# EAGLE design TZATZIKI_v2 (EAGLE 7.6.0)
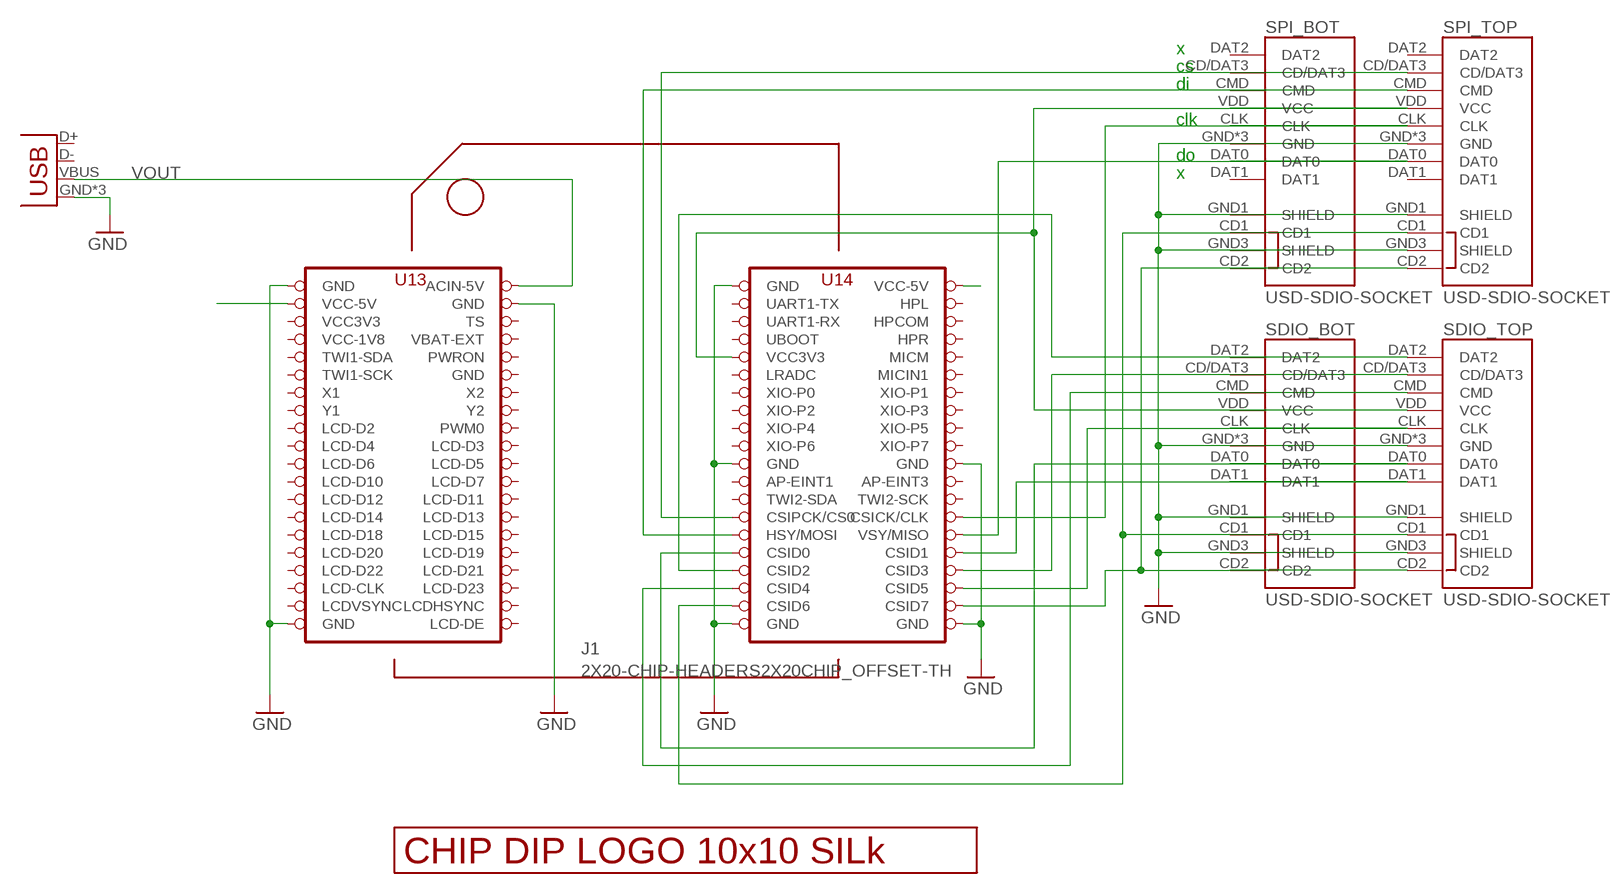
[diagram p0: schematic, sheet 1]

## Parts
J1  2X20-CHIP-HEADERS2X20CHIP_OFFSET-TH  [2X20CHIP_OFFSET-TH]
POWER_USB  USBUSB-MICROB-SMT-DIP  [USB-MICROB-SMT-DIP]
SDIO_BOT  USD-SDIO-SOCKET  [MICRO-SD-SOCKET-SDIO]
SDIO_TOP  USD-SDIO-SOCKET  [MICRO-SD-SOCKET-SDIO]
SPI_BOT  USD-SDIO-SOCKET  [MICRO-SD-SOCKET-SDIO]
SPI_TOP  USD-SDIO-SOCKET  [MICRO-SD-SOCKET-SDIO]
U$1  LOGO_10X10_SILK  [LOGO_10X10_SILK]

## Nets
GND: J1.GND@1(GND) J1.GND@2(GND) J1.GND@4(GND) J1.GND@5(GND) J1.GND@6(GND) J1.GND@7(GND) J1.GND@8(GND) J1.GND@10(GND) POWER_USB.GND POWER_USB.MT1(GND) POWER_USB.MT2(GND) SDIO_BOT.GND SDIO_BOT.GND1(SHIELD) SDIO_BOT.GND3(SHIELD) SDIO_BOT.GND@1(GND) SDIO_BOT.GND@2(GND) SDIO_TOP.GND SDIO_TOP.GND1(SHIELD) SDIO_TOP.GND3(SHIELD) SDIO_TOP.GND@1(GND) SDIO_TOP.GND@2(GND) SPI_BOT.GND SPI_BOT.GND1(SHIELD) SPI_BOT.GND3(SHIELD) SPI_BOT.GND@1(GND) SPI_BOT.GND@2(GND) SPI_TOP.GND SPI_TOP.GND1(SHIELD) SPI_TOP.GND3(SHIELD) SPI_TOP.GND@1(GND) SPI_TOP.GND@2(GND)
N$1: J1.CSID7 SDIO_BOT.CD2 SDIO_TOP.CD2 SPI_BOT.CD2 SPI_TOP.CD2
N$2: J1.CSID3 SDIO_BOT.CD/DAT3 SDIO_TOP.CD/DAT3
N$3: J1.CSID0 SDIO_BOT.DAT0 SDIO_TOP.DAT0
N$4: J1.CSID4 SDIO_BOT.CMD SDIO_TOP.CMD
N$5: J1.CSID5 SDIO_BOT.CLK SDIO_TOP.CLK
N$6: J1.CSID1 SDIO_BOT.DAT1 SDIO_TOP.DAT1
N$7: J1.VCC5V@1(VCC-5V)
N$8: J1.VCC5V@0(VCC-5V)
N$9: J1.CSID2 SDIO_BOT.DAT2 SDIO_TOP.DAT2
N$10: J1.VCC3V3@1(VCC3V3) SDIO_BOT.VDD(VCC) SDIO_TOP.VDD(VCC) SPI_BOT.VDD(VCC) SPI_TOP.VDD(VCC)
N$11: J1.CSIPCK(CSIPCK/CS0) SPI_BOT.CD/DAT3 SPI_TOP.CD/DAT3
N$12: J1.CSIHSYNC(HSY/MOSI) SPI_BOT.CMD SPI_TOP.CMD
N$13: J1.CSIVSYNC(VSY/MISO) SPI_BOT.DAT0 SPI_TOP.DAT0
N$14: J1.CSICK(CSICK/CLK) SPI_BOT.CLK SPI_TOP.CLK
N$19: J1.CSID6 SDIO_BOT.CD1 SDIO_TOP.CD1 SPI_BOT.CD1 SPI_TOP.CD1
VOUT: J1.CHG-IN(ACIN-5V) POWER_USB.VBUS
Unconnected: J1.AP-EINT1 J1.AP-EINT3 J1.BAT(VBAT-EXT) J1.FEL(UBOOT) J1.HPCOM J1.HPL J1.HPR J1.LCD-CLK J1.LCD-D2 J1.LCD-D3 J1.LCD-D4 J1.LCD-D5 J1.LCD-D6 J1.LCD-D7 J1.LCD-D10 J1.LCD-D11 J1.LCD-D12 J1.LCD-D13 J1.LCD-D14 J1.LCD-D15 J1.LCD-D18 J1.LCD-D19 J1.LCD-D20 J1.LCD-D21 J1.LCD-D22 J1.LCD-D23 J1.LCD-DE J1.LCD-HSYNC(LCDHSYNC) J1.LCD-VSYNC(LCDVSYNC) J1.LRADC J1.MICIN1 J1.MICM J1.PWM0 J1.PWRON J1.TS J1.TWI1-SCK J1.TWI1-SDA J1.TWI2-SCK J1.TWI2-SDA J1.UART1-RX J1.UART1-TX J1.X1 J1.X2 J1.XIO-P0 J1.XIO-P1 J1.XIO-P2 J1.XIO-P3 J1.XIO-P4 J1.XIO-P5 J1.XIO-P6 J1.XIO-P7 J1.Y1 J1.Y2 POWER_USB.D+ POWER_USB.D- SPI_BOT.DAT1 SPI_BOT.DAT2 SPI_TOP.DAT1 SPI_TOP.DAT2

## Notes on the sheet
- x
- cs
- di
- clk
- do
- x

## Power pins joined to a net without a drawn wire
GND: J1.GND@3(GND)
VCC3V3: J1.VCC3V3
VCC-1V8: J1.VCC1V8(VCC-1V8)

## Library data of the parts
J1 = JKW_CHIP:2X20-CHIP-HEADERS: Through hole layout with chip reference
POWER_USB = Spark:USB
SDIO_BOT SDIO_TOP SPI_BOT SPI_TOP = JKW_CHIP:USD-SDIO-SOCKET: microSD Socket Push-push type uSD socket with full SDIO signal mapping. Spark Fun Electronics SKU : PRT-00127. tDoc lines correctly indicate media card edge positions when inserting (unlocked, locked, depressed). NOTE: CD1 and CD2 are connected internally, and short to ground when card is removed.; PROD_ID: SCHD3A0100
U$1 = JKW_CHIP:LOGO_10X10_SILK

## Board
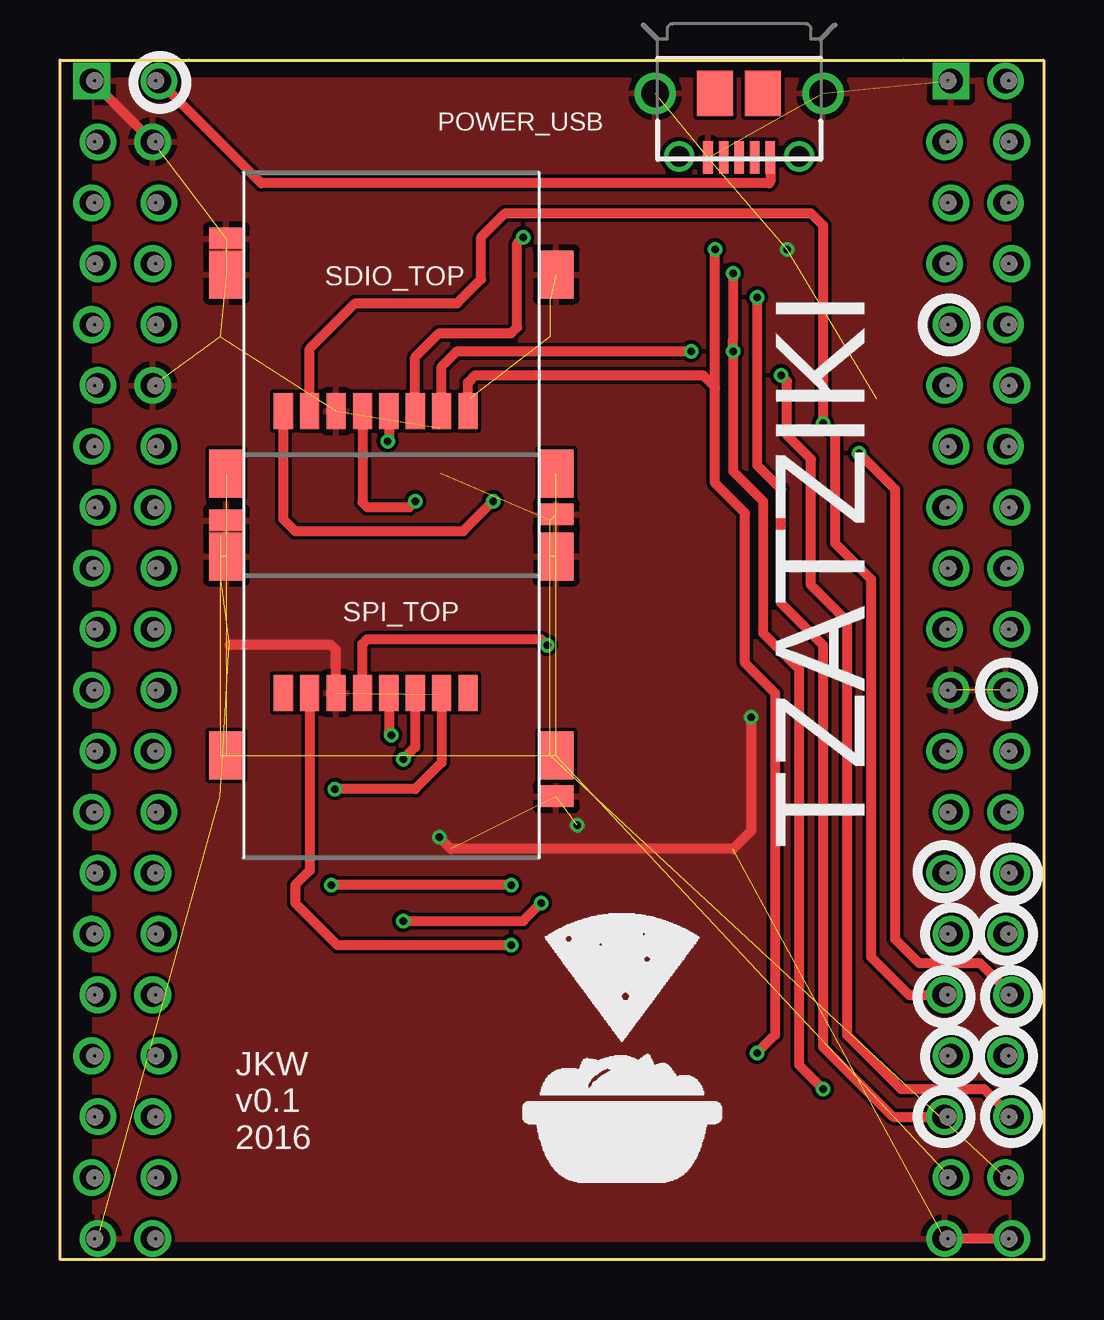
[diagram p1: board, top side]
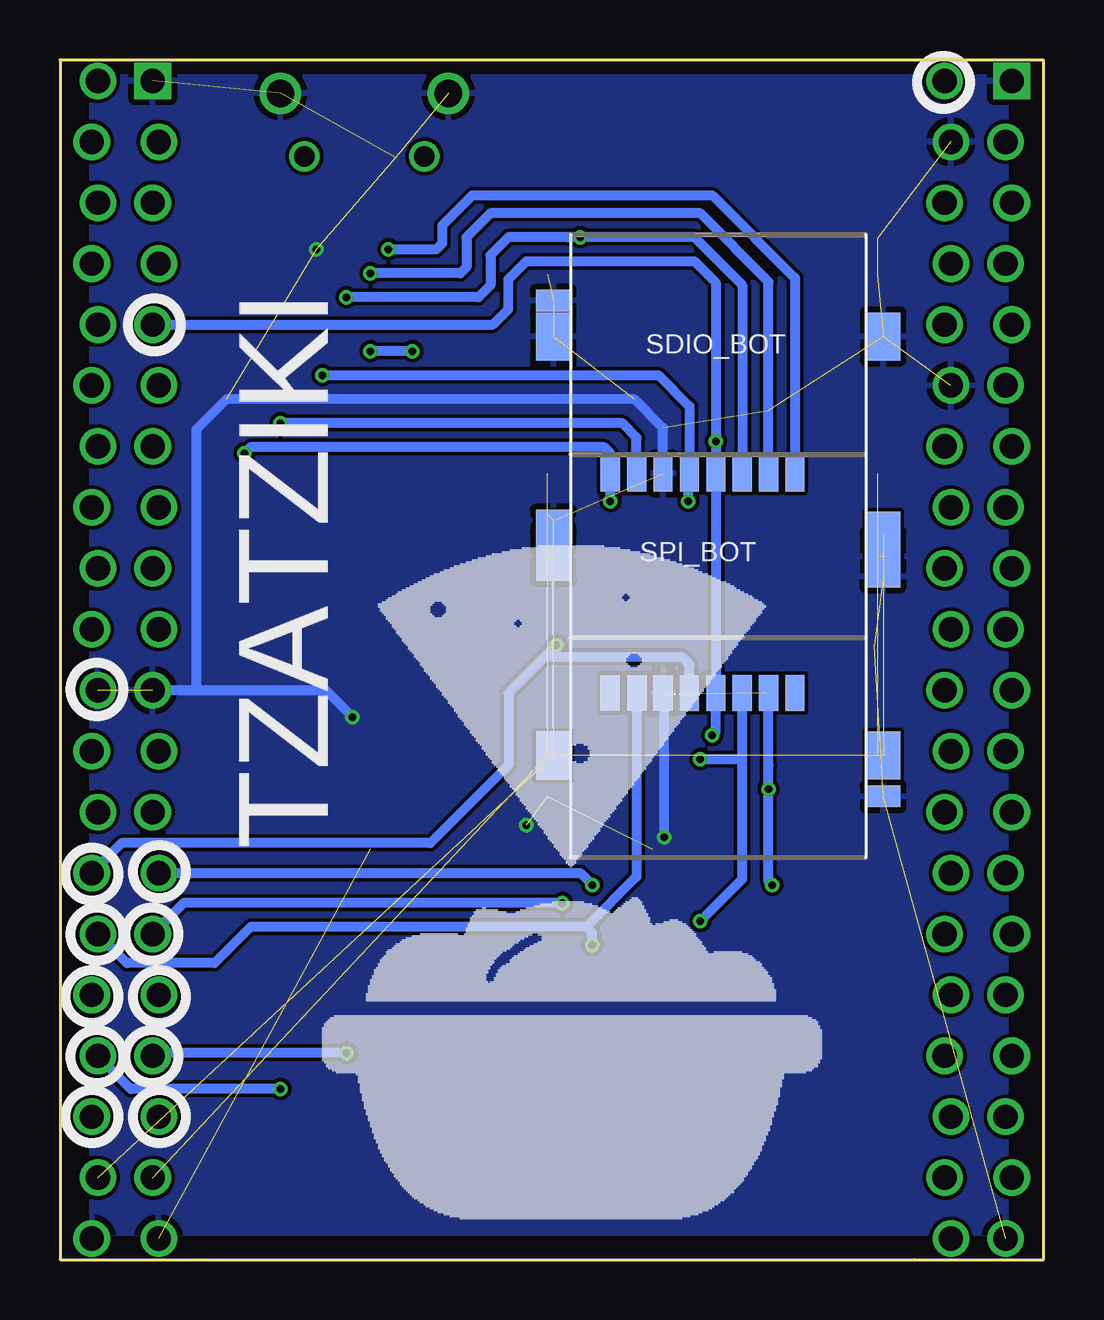
[diagram p2: board, bottom side, seen from below]

Size 41 x 50 mm. Coordinates in mm from the lower left corner, seen from the top.
Copper layers (1*16): Top 0.035mm / dielectric 1.6mm / Bottom 0.035mm
Design rules "Elecrow_2-layer_PCB_eagle_rule": minimum track width 6mil, minimum drill 12mil, track to track 6mil, track to pad 6mil, pad to pad 6mil, via to via 8mil, smd to smd 0mil, copper to edge 20mil, drill to drill 10mil, minimum pad ring 6mil, minimum via ring 6mil, stop-mask expansion 0mil, vias tented up to drill 100mil, thermal gap 10mil

### Footprints (pad centres in the part's own frame; a part is rotated, then mirrored left to right if it is on the bottom)
2X20CHIP_OFFSET-TH = drill 1.016: AP-EINT1 15.113,-3.81; AP-EINT3 17.907,-3.81; BAT -17.907,16.51; CHG-IN -17.653,24.13; CSICK 17.907,-8.89; CSID0 15.113,-13.97; CSID1 17.907,-13.97; CSID2 15.367,-16.51; CSID3 17.653,-16.51; CSID4 15.113,-19.05; CSID5 17.907,-19.05; CSID6 15.367,-21.59; CSID7 17.653,-21.59; CSIHSYNC 15.367,-11.43; CSIPCK 15.113,-8.89; CSIVSYNC 17.653,-11.43; FEL 15.113,16.51; GND@1 -17.907,11.43; GND@2 -20.193,-24.13; GND@4 17.653,-1.27; GND@5 17.907,-24.13; GND@6 15.113,-24.13; GND@7 15.367,-1.27; GND@10 -17.907,21.59; HPCOM 17.653,19.05; HPL 17.907,21.59; HPR 17.907,16.51; LCD-CLK -20.193,-19.05; LCD-D2 -20.447,3.81; LCD-D3 -17.907,1.27; LCD-D4 -20.193,1.27; LCD-D5 -17.653,-1.27; LCD-D6 -20.447,-1.27; LCD-D7 -17.907,-3.81; LCD-D10 -20.193,-3.81; LCD-D11 -17.653,-6.35; LCD-D12 -20.447,-6.35; LCD-D13 -17.907,-8.89; LCD-D14 -20.193,-8.89; LCD-D15 -17.653,-11.43; LCD-D18 -20.447,-11.43; LCD-D19 -17.907,-13.97; LCD-D20 -20.193,-13.97; LCD-D21 -17.653,-16.51; LCD-D22 -20.447,-16.51; LCD-D23 -17.907,-19.05; LCD-DE -17.907,-24.13; LCD-HSYNC -17.653,-21.59; LCD-VSYNC -20.447,-21.59; LRADC 15.113,11.43; MICIN1 17.907,11.43; MICM 17.653,13.97; PWM0 -17.653,3.81; PWRON -17.653,13.97; TS -17.653,19.05; TWI1-SCK -20.193,11.43; TWI1-SDA -20.447,13.97; TWI2-SCK 17.653,-6.35; TWI2-SDA 15.367,-6.35; UART1-RX 15.367,19.05; UART1-TX 15.113,21.59; VCC1V8 -20.193,16.51; VCC3V3 -20.447,19.05; VCC3V3@1 15.367,13.97; VCC5V@0 -20.193,21.59; VCC5V@1 17.653,24.13; X1 -20.447,8.89; X2 -17.653,8.89; XIO-P0 15.367,8.89; XIO-P1 17.653,8.89; XIO-P2 15.113,6.35; XIO-P3 17.907,6.35; XIO-P4 15.367,3.81; XIO-P5 17.653,3.81; XIO-P6 15.113,1.27; XIO-P7 17.907,1.27; Y1 -20.193,6.35; Y2 -17.907,6.35 | drill 1.016 square: GND@3 -20.447,24.13; GND@8 15.367,24.13
USB-MICROB-SMT-DIP = smd 0.4 x 1.35: D+ 0,2.675; D- -0.65,2.675; GND 1.3,2.675; ID 0.65,2.675; VBUS -1.3,2.675 | drill 1.15 pad 1.7: MT1 -3.5,0; MT2 3.5,0 | drill 0.85 pad 1.25: MT3 -2.5,2.625; MT4 2.5,2.625 | smd 1.5 x 1.9: P$1 -1,0; P$2 1,0.01
MICRO-SD-SOCKET-SDIO = smd 1.45 x 2: CD1 6.875,-3.35; CD2 -6.875,-3.35; GND1 -6.875,4.95; GND3 6.875,4.95 | smd 0.8 x 1.5: CD/DAT3 2.1,-0.75; CLK -1.2,-0.75; CMD 1,-0.75; DAT0 -3.4,-0.75; DAT1 -4.5,-0.75; DAT2 3.2,-0.75; GND -2.3,-0.75; VDD -0.1,-0.75 | smd 1.45 x 0.9: GND@1 -6.875,6.45; GND@2 6.875,-5.05

### Placement (x,y rotation side)
J1  21.77,25 0 top
POWER_USB  28.31,48.61 180 top
SDIO_BOT  13.56,33.52 0 bottom
SDIO_TOP  13.81,36.11 0 top
SPI_BOT  13.56,24.36 0 bottom
SPI_TOP  13.81,24.36 0 top
U$1  19.26,3.19 0 top
U$2  LOGO_25X25_SILK  [LOGO_25X25_SILK]  30.11,1.64 0 bottom

### Tracks (layer width: path | path; a pad name or v marks a point on that pad's centre or on a via)
GND  (via drill 0.3)  (29 unrouted)
  Top 0.406: J1.GND@3 J1.GND@10 | J1.GND@5 J1.GND@6 | v28.81,22.61 28.81,17.86 28.06,17.11 16.31,17.11 v15.81,17.61 | SPI_TOP.GND 11.51,25.41 11.31,25.61 7.06,25.61
  Bottom 0.406: v28.81,22.61 29.93,23.73 J1.GND@7 35.44,23.73 35.31,23.86 35.31,34.61 34.06,35.86 17.06,35.86 15.86,34.66 SDIO_BOT.GND | v15.81,17.61 15.81,23.56 SPI_BOT.GND
  other vias: 21.56,18.11 30.31,42.11
  pour Top: 1.45,0.87 39.55,0.87 39.55,49.13 1.45,49.13
  pour Bottom: 39.67,1.12 1.57,1.12 1.57,49.38 39.67,49.38
N$1  (4 unrouted)
N$2  (via drill 0.3)
  Top 0.406: v31.81,7.11 30.81,8.11 30.81,24.61 29.31,26.11 29.31,31.61 28.06,32.86 v28.06,37.86 28.06,38.36 v28.06,41.11 | SDIO_TOP.CD/DAT3 15.91,37.21 16.56,37.86 v26.31,37.86
  Bottom 0.406: v31.81,7.11 38.04,7.11 J1.CSID3 | SDIO_BOT.CD/DAT3 11.46,40.76 14.31,43.61 23.06,43.61 24.06,42.61 24.06,41.36 24.31,41.11 v28.06,41.11 | v26.31,37.86 v28.06,37.86
N$3  (via drill 0.3)
  Top 0.406: J1.CSID0 35.39,11.03 33.81,12.61 33.81,28.36 32.31,29.86 32.31,34.36 v31.81,34.86 31.81,43.11 31.31,43.61 18.56,43.61 17.56,42.61 17.56,40.86 16.56,39.86 12.31,39.86 10.41,37.96 SDIO_TOP.DAT0
  Bottom 0.406: SDIO_BOT.DAT0 16.96,34.26 17.56,34.86 v31.81,34.86
N$4  (via drill 0.3)
  Top 0.406: J1.CSID4 34.72,5.95 31.81,8.86 31.81,25.61 30.06,27.36 30.06,32.11 29.06,33.11 v29.06,40.11 | SDIO_TOP.CMD 14.81,37.61 15.81,38.61 18.81,38.61 19.06,38.86 19.06,42.36 v19.31,42.61
  Bottom 0.406: SDIO_BOT.CMD 12.56,40.61 14.56,42.61 v19.31,42.61 19.81,42.61 22.31,42.61 23.06,41.86 23.06,40.61 23.56,40.11 v29.06,40.11
N$5  (via drill 0.3)
  Top 0.406: J1.CSID5 38.52,7.11 35.06,7.11 32.81,9.36 32.81,26.61 31.31,28.11 31.31,33.36 30.31,34.36 30.31,36.61 v30.06,36.86 | SDIO_TOP.CLK 12.61,31.56 12.81,31.36 14.56,31.36 v14.81,31.61
  Bottom 0.406: v30.06,36.86 16.06,36.86 14.76,35.56 SDIO_BOT.CLK 14.81,32.72 v14.81,31.61
N$6  (via drill 0.3)
  Top 0.406: J1.CSID1 38.35,12.36 35.81,12.36 34.81,13.36 34.81,32.11 v33.31,33.61 | SDIO_TOP.DAT1 9.31,30.86 9.81,30.36 16.81,30.36 v18.06,31.61
  Bottom 0.406: v33.31,33.61 33.06,33.86 18.31,33.86 18.06,33.61 SDIO_BOT.DAT1 v18.06,31.61
N$9  (via drill 0.3)
  Top 0.406: v29.06,8.61 29.81,9.36 29.81,23.61 28.56,24.86 28.56,31.11 27.31,32.36 27.31,36.36 | 27.31,36.36 v27.31,42.11 | SDIO_TOP.DAT2 17.01,36.56 17.31,36.86 26.81,36.86 27.31,36.36
  Bottom 0.406: v29.06,8.61 37.02,8.61 J1.CSID2 | v27.31,42.11 25.31,42.11 25.06,42.36 25.06,43.11 23.81,44.36 13.81,44.36 10.36,40.91 SDIO_BOT.DAT2
N$10  (via drill 0.3)
  Top 0.406: SPI_TOP.VDD 13.71,21.96 v13.81,21.86 | SDIO_TOP.VDD 13.71,34.16 v13.66,34.11
  Bottom 0.406: 37,39.11 J1.VCC3V3@1 22.95,38.97 22.31,39.61 22.31,40.86 21.56,41.61 14.56,41.61 13.66,40.71 v13.66,34.11 SDIO_BOT.VDD | SDIO_BOT.VDD 13.56,32.87 | SDIO_BOT.VDD SPI_BOT.VDD 13.66,22.01 v13.81,21.86
N$11  (via drill 0.3)
  Top 0.406: v18.81,15.61 v11.31,15.61 | SPI_TOP.CD/DAT3 15.91,20.71 14.81,19.61 v11.46,19.61
  Bottom 0.406: J1.CSIPCK 19.31,16.11 v18.81,15.61 | v11.31,15.61 11.46,15.76 v11.46,19.61 11.46,20.61 SPI_BOT.CD/DAT3
N$12  (via drill 0.3)
  Top 0.406: v14.31,14.11 19.31,14.11 v20.06,14.86 | SPI_TOP.CMD 14.81,21.36 v14.31,20.86
  Bottom 0.406: v14.31,14.11 12.56,15.86 12.56,20.86 | v20.06,14.86 35.85,14.86 J1.CSIHSYNC | 12.56,20.86 SPI_BOT.CMD | v14.31,20.86 12.56,20.86
N$13  (via drill 0.3)
  Top 0.406: SPI_TOP.DAT0 10.41,16.21 9.81,15.61 9.81,14.86 11.56,13.11 v18.81,13.11
  Bottom 0.406: SPI_BOT.DAT0 16.96,15.96 19.06,13.86 | 19.06,13.86 33.06,13.86 34.56,12.36 38.21,12.36 J1.CSIVSYNC | v18.81,13.11 18.81,13.61 19.06,13.86
N$14  (via drill 0.3)
  Top 0.406: SPI_TOP.CLK 12.61,25.66 12.81,25.86 20.06,25.86 v20.31,25.61
  Bottom 0.406: SPI_BOT.CLK 14.76,24.81 15.06,25.11 20.81,25.11 | 20.81,25.11 22.31,23.61 22.31,20.61 25.56,17.36 38.43,17.36 J1.CSICK | v20.31,25.61 20.81,25.11
N$19  (4 unrouted)
VOUT
  Top 0.406: POWER_USB.VBUS 29.61,44.91 29.56,44.86 8.39,44.86 J1.CHG-IN

### Text on the board
Unrouted: Ordered 2016/08/08 OSH
tNames: TZATZIKI | JKW / v0.1 / 2016
bNames: TZATZIKI